# Altium project DARKYDEN.PrjPcb (part 4 of 15)

## Sheet HDMI.SchDoc: DARKYDEN_HDMI
size Letter; ApprovedBy: APPROUVÉ PAR; Author: Harold Malbrouck; Organization: Cegep Limoilou; Address1: 1300, 8e Avenue; Address2: Québec, QC; Address3: Canada; Address4: G1J 5L5; Revision: Rev.A; SheetNumber: 4; SheetTotal: 22
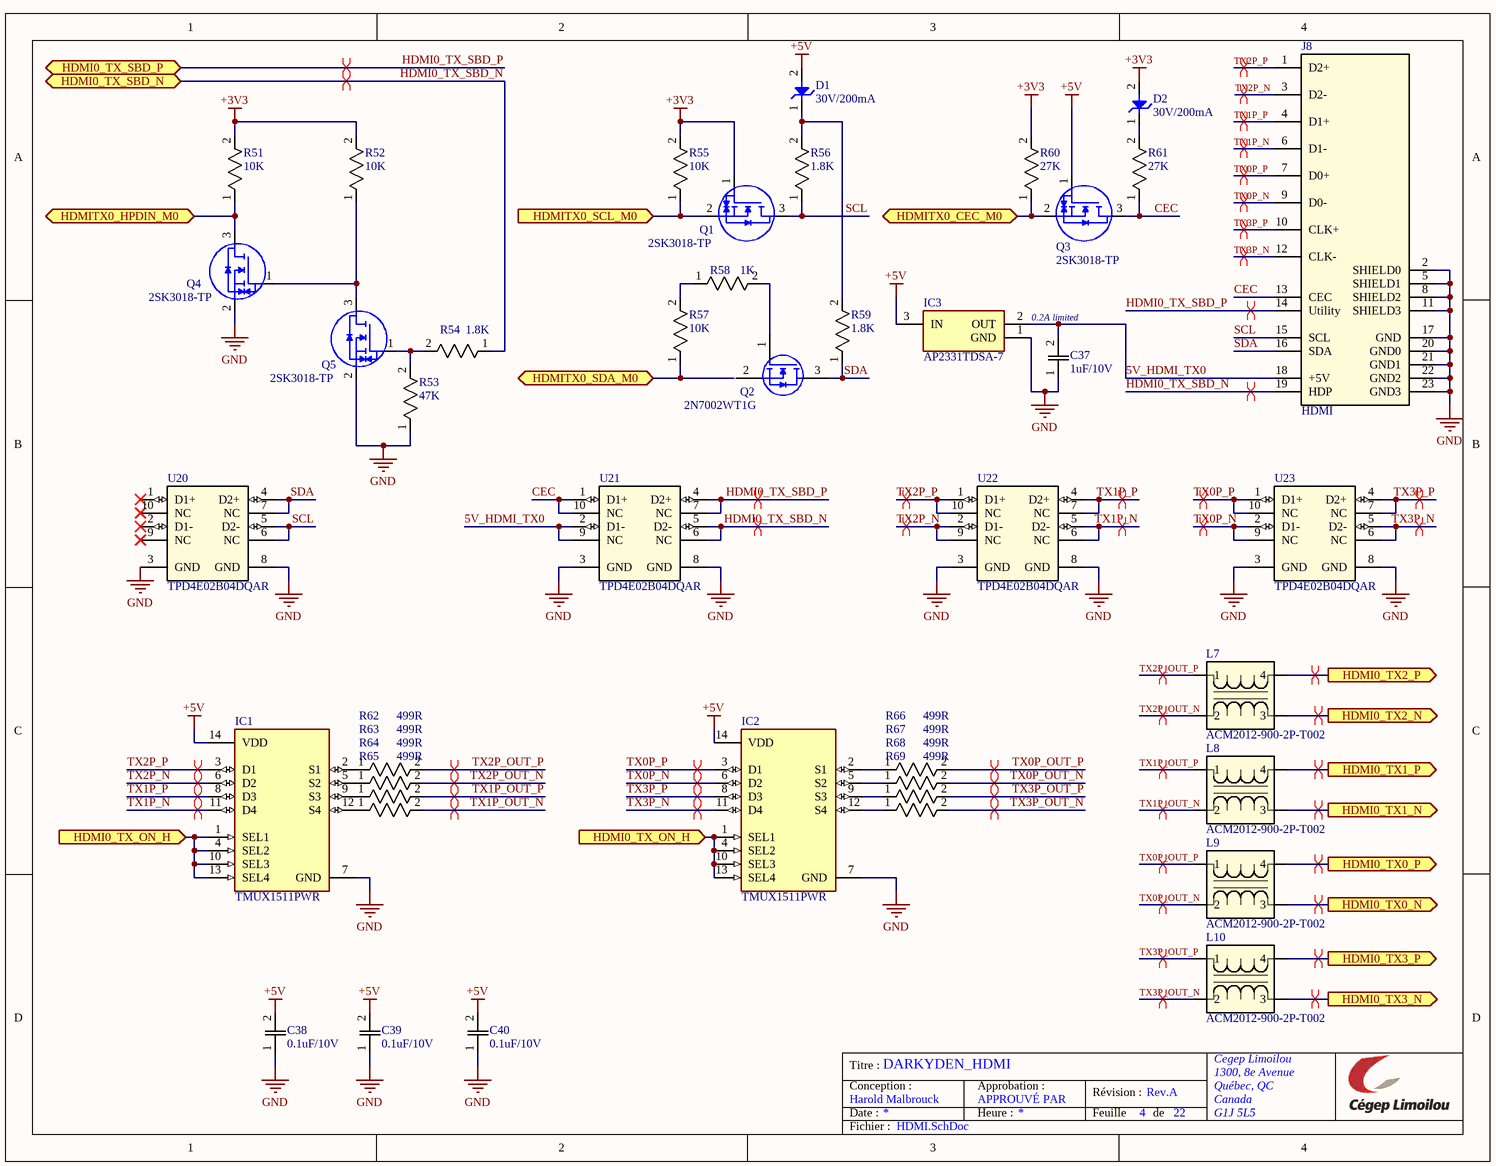
[diagram p3: HDMI.SchDoc]

### Parts
C37  1uF/10V  [CAPC220145_88N_KEM]
C38  0.1uF/10V  [CAPC220145_88N_KEM]
C39  0.1uF/10V  [CAPC220145_88N_KEM]
C40  0.1uF/10V  [CAPC220145_88N_KEM]
D1  30V/200mA  [SODFL1608X70N]
D2  30V/200mA  [SODFL1608X70N]
IC1  TMUX1511PWR  [SOP65P640X120-14N]
IC2  TMUX1511PWR  [SOP65P640X120-14N]
IC3  AP2331TDSA-7  [SOT96P240X110-3N]
J8  HDMI  [CONN19_2001-1-2-21-00-BK_CNC]
L7  ACM2012-900-2P-T002  [ACM20129002PT002]
L8  ACM2012-900-2P-T002  [ACM20129002PT002]
L9  ACM2012-900-2P-T002  [ACM20129002PT002]
L10  ACM2012-900-2P-T002  [ACM20129002PT002]
Q1  2SK3018-TP  [SOT65P228X120-3N]
Q2  2N7002WT1G  [SOT-323-3_2P2X1P35_ONS]
Q3  2SK3018-TP  [SOT65P228X120-3N]
Q4  2SK3018-TP  [SOT65P228X120-3N]
Q5  2SK3018-TP  [SOT65P228X120-3N]
R51  10K  [ERJ3EKF1000V]
R52  10K  [ERJ3EKF1000V]
R53  47K  [RC0603N_PAN]
R54  1.8K  [RC0603N_PAN]
R55  10K  [ERJ3EKF1000V]
R56  1.8K  [RC0603N_PAN]
R57  10K  [ERJ3EKF1000V]
R58  1K  [RESC1608X55N]
R59  1.8K  [RC0603N_PAN]
R60  27K  [RC0603N_PAN]
R61  27K  [RC0603N_PAN]
R62  499R  [RC0603N_PAN]
R63  499R  [RC0603N_PAN]
R64  499R  [RC0603N_PAN]
R65  499R  [RC0603N_PAN]
R66  499R  [RC0603N_PAN]
R67  499R  [RC0603N_PAN]
R68  499R  [RC0603N_PAN]
R69  499R  [RC0603N_PAN]
U20  TPD4E02B04DQAR  [DQA0010A]
U21  TPD4E02B04DQAR  [DQA0010A]
U22  TPD4E02B04DQAR  [DQA0010A]
U23  TPD4E02B04DQAR  [DQA0010A]

### Ports
HDMI0_TX0_N (out, see CONNECTEUR_4[1B]), HDMI0_TX0_P (out, see CONNECTEUR_4[1B]), HDMI0_TX1_N (out, see CONNECTEUR_4[1B]), HDMI0_TX1_P (out, see CONNECTEUR_4[1B]), HDMI0_TX2_N (out, see CONNECTEUR_4[1B]), HDMI0_TX2_P (out, see CONNECTEUR_4[1B]), HDMI0_TX3_N (out, see CONNECTEUR_4[1B]), HDMI0_TX3_P (out, see CONNECTEUR_4[1B]), HDMI0_TX_ON_H (in, see CONNECTEUR_4[1C], HDMI[1C]), HDMI0_TX_ON_H (in, see CONNECTEUR_4[1C], HDMI[2C]), HDMI0_TX_SBD_N (bidir, see CONNECTEUR_4[1B]), HDMI0_TX_SBD_P (bidir, see CONNECTEUR_4[1B]), HDMITX0_CEC_M0 (bidir, see CONNECTEUR_4[1B]), HDMITX0_HPDIN_M0 (bidir, see CONNECTEUR_3[1C]), HDMITX0_SCL_M0 (in, see CONNECTEUR_4[1B]), HDMITX0_SDA_M0 (bidir, see CONNECTEUR_4[1B])

### Nets
+3V3: D2.2(A) Q1.1(G) R51.2 R52.2 R55.2 R60.2  [project net VDD33A]
+5V: C38.2 C39.2 C40.2 D1.2(A) IC1.14(VDD) IC2.14(VDD) IC3.3(IN) Q3.1(G)
GND: C37.1 C38.1 C39.1 C40.1 IC1.7(GND) IC2.7(GND) IC3.1(GND) J8.2(SHIELD0) J8.5(SHIELD1) J8.8(SHIELD2) J8.11(SHIELD3) J8.17(GND) J8.20(GND0) J8.21(GND1) J8.22(GND2) J8.23(GND3) Q4.2(S) Q5.2(S) R53.1 U20.3(GND) U20.8(GND) U21.3(GND) U21.8(GND) U22.3(GND) U22.8(GND) U23.3(GND) U23.8(GND)  [project net PACK-]
5V_HDMI_TX0: C37.2 IC3.2(OUT) J8.18(+5V) U21.2(D1-) U21.9(NC)
CEC: J8.13(CEC) Q3.3(D) R61.1 U21.1(D1+) U21.10(NC)
HDMI0_TX0_N: L9.3 ; port HDMI0_TX0_N
HDMI0_TX0_P: L9.4 ; port HDMI0_TX0_P
HDMI0_TX1_N: L8.3 ; port HDMI0_TX1_N
HDMI0_TX1_P: L8.4 ; port HDMI0_TX1_P
HDMI0_TX2_N: L7.3 ; port HDMI0_TX2_N
HDMI0_TX2_P: L7.4 ; port HDMI0_TX2_P
HDMI0_TX3_N: L10.3 ; port HDMI0_TX3_N
HDMI0_TX3_P: L10.4 ; port HDMI0_TX3_P
HDMI0_TX_ON_H: IC1.1(SEL1) IC1.4(SEL2) IC1.10(SEL3) IC1.13(SEL4) IC2.1(SEL1) IC2.4(SEL2) IC2.10(SEL3) IC2.13(SEL4) ; port HDMI0_TX_ON_H
HDMI0_TX_SBD_N: J8.19(HDP) R54.1 U21.5(D2-) U21.6(NC) ; port HDMI0_TX_SBD_N
HDMI0_TX_SBD_P: J8.14(Utility) U21.4(D2+) U21.7(NC) ; port HDMI0_TX_SBD_P
HDMITX0_CEC_M0: Q3.2(S) R60.1 ; port HDMITX0_CEC_M0
HDMITX0_HPDIN_M0: Q4.3(D) R51.1 ; port HDMITX0_HPDIN_M0
HDMITX0_SCL_M0: Q1.2(S) R55.1 ; port HDMITX0_SCL_M0
HDMITX0_SDA_M0: R57.1 ; port HDMITX0_SDA_M0
SCL: J8.15(SCL) Q1.3(D) R56.1 U20.5(D2-) U20.6(NC)
SDA: J8.16(SDA) Q2.3(DRAIN) R59.1 U20.4(D2+) U20.7(NC)
TX0P_N: IC2.6(D2) J8.9(D0-) U23.2(D1-) U23.9(NC)
TX0P_OUT_N: L9.2 R67.2
TX0P_OUT_P: L9.1 R66.2
TX0P_P: IC2.3(D1) J8.7(D0+) U23.1(D1+) U23.10(NC)
TX1P_N: IC1.11(D4) J8.6(D1-) U22.5(D2-) U22.6(NC)
TX1P_OUT_N: L8.2 R65.2
TX1P_OUT_P: L8.1 R64.2
TX1P_P: IC1.8(D3) J8.4(D1+) U22.4(D2+) U22.7(NC)
TX2P_N: IC1.6(D2) J8.3(D2-) U22.2(D1-) U22.9(NC)
TX2P_OUT_N: L7.2 R63.2
TX2P_OUT_P: L7.1 R62.2
TX2P_P: IC1.3(D1) J8.1(D2+) U22.1(D1+) U22.10(NC)
TX3P_N: IC2.11(D4) J8.12(CLK-) U23.5(D2-) U23.6(NC)
TX3P_OUT_N: L10.2 R69.2
TX3P_OUT_P: L10.1 R68.2
TX3P_P: IC2.8(D3) J8.10(CLK+) U23.4(D2+) U23.7(NC)
NetD1_1: D1.1(K) R56.2 R59.2
NetD2_1: D2.1(K) R61.2
NetIC1_2: IC1.2(S1) R62.1
NetIC1_5: IC1.5(S2) R63.1
NetIC1_9: IC1.9(S3) R64.1
NetIC1_12: IC1.12(S4) R65.1
NetIC2_2: IC2.2(S1) R66.1
NetIC2_5: IC2.5(S2) R67.1
NetIC2_9: IC2.9(S3) R68.1
NetIC2_12: IC2.12(S4) R69.1
NetQ2_1: Q2.1(GATE) R58.2
NetQ4_1: Q4.1(G) Q5.3(D) R52.1
NetQ5_1: Q5.1(G) R53.2 R54.2
NetR57_2: R57.2 R58.1

Not connected (* = marked no-connect by the designer): Q2 2(SOURCE); U20 1(D1+)* 2(D1-)* 9(NC)* 10(NC)*

### Layout directives
differential pair: HDMI0_TX0_N, HDMI0_TX0_P, HDMI0_TX1_N, HDMI0_TX1_P, HDMI0_TX2_N, HDMI0_TX2_P, HDMI0_TX3_N, HDMI0_TX3_P, HDMI0_TX_SBD_N, HDMI0_TX_SBD_P, TX0P_N, TX0P_OUT_N, TX0P_OUT_P, TX0P_P, TX1P_N, TX1P_OUT_N, TX1P_OUT_P, TX1P_P, TX2P_N, TX2P_OUT_N, TX2P_OUT_P, TX2P_P, TX3P_N, TX3P_OUT_N, TX3P_OUT_P, TX3P_P

### Notes on the sheet
- 0.2A limited
- Titre :
- Conception :
- Date :
- Approbation :
- Heure :
- Révision :
- Feuille
- de
- Fichier :

### Library data of the parts
C37 = C0805C105K8RACTU: Multilayer Ceramic Capacitors MLCC - SMD/SMT 10V 1uF X7R 0805 10%; Mfr_Name: Kemet; Material: 4241ConductorMaterial; Dissipation Factor: 5%; Supplier: Digikey; Supplier Part Number: 399-C0805C105K8RACTUCT-ND; Manufacturer: KEMET; Manufacturer Part Number: C0805C105K8RACTU; RoHS: Yes; Category: Ceramic Capacitors; Stock: 113387; Pricing: 1=0.2, 10=0.112, 100=0.0701, 1000=0.04837 (USD); Mounting Technology: Surface Mount; Case/Package: 0805; Pins: 2NUMBER; Case Code (Imperial): 0805; Case Code (Metric): 2012; Dielectric Material: Ceramic; Min Operating Temperature: -55°C; Max Operating Temperature: 125°C; Packaging: Tape and Reel; Tolerance: 10%; Value: 1uF; Dielectric: X7R; Package Quantity: 1; Voltage Rating: 10V; Voltage Rating (DC): 10V; Termination: SMD/SMT; Voltage: 10V; Series: C; Construction: Flat; Length: 2mm; Width: 0.049inch; Height: 0.9mm; Depth: 1.25mm; Thickness: 0.039inch; Lead Pitch: 0.75mm; Radiation Hardening: No; Reach SVHC Compliant: No; RoHS Compliant: Yes; Lead Free: 5697LeadFree; ComponentLink1URL: https://datasheet.ciiva.com/6074/kem-c1002-x7r-smd-6074662.pdf?src-supplier=Farnell; ComponentLink1Description: https://datasheet.ciiva.com/6074/kem-c1002-x7r-smd-6074662.pdf?src-supplier=Farnell; ComponentLink2URL: https://datasheet.ciiva.com/22749/1918693-22749723.pdf?src-supplier=Element14; ComponentLink2Description: https://datasheet.ciiva.com/22749/1918693-22749723.pdf?src-supplier=Element14; ComponentLink3URL: https://datasheet.ciiva.com/46385/1851736-46385656.pdf?src-supplier=Element14; ComponentLink3Description: https://datasheet.ciiva.com/46385/1851736-46385656.pdf?src-supplier=Element14; ComponentLink4URL: https://datasheet.ciiva.com/46443/1851736-46443534.pdf?src-supplier=Element14; ComponentLink4Description: https://datasheet.ciiva.com/46443/1851736-46443534.pdf?src-supplier=Element14
C38-C40 = C0805C104J8RACTU: Cap Ceramic 0.1uF 10V X7R 5% Pad SMD 0805 125C T/R; Mfr_Name: Kemet; Material: 4241ConductorMaterial; Value: 100nF; Temperature Coefficient: 30ppm/°C; Supplier: Digikey; Supplier Part Number: 399-C0805C104J8RACTUCT-ND; Manufacturer: KEMET; Manufacturer Part Number: C0805C104J8RACTU; RoHS: Yes; Category: Ceramic Capacitors; Stock: 7602; Pricing: 1=0.54, 10=0.331, 100=0.1983, 1000=0.14915 (USD); Mounting Technology: Surface Mount; Case/Package: 0805; Case Code (Metric): 2012; Case Code (Imperial): 0805; Dielectric Material: Ceramic; Min Operating Temperature: -55°C; Max Operating Temperature: 125°C; Voltage Rating: 10V; Voltage Rating (DC): 10V; Tolerance: 5%; Packaging: Tape and Reel; Package Quantity: 1; Dielectric: X7R; Termination: SMD/SMT; Series: C; Construction: Flat; Length: 2mm; Width: 0.049inch; Height: 0.9mm; Thickness: 0.035inch; Lead Pitch: 0.75mm; Depth: 1.25mm; Radiation Hardening: No; Reach SVHC Compliant: No; RoHS Compliant: Yes; ComponentLink1URL: http://www.farnell.com/datasheets/2552466.pdf?src-supplier=Farnell; ComponentLink1Description: http://www.farnell.com/datasheets/2552466.pdf?src-supplier=Farnell; ComponentLink2URL: http://www.mouser.com/ds/2/212/KEM_C1002_X7R_SMD-1102033.pdf?src-supplier=Mouser; ComponentLink2Description: http://www.mouser.com/ds/2/212/KEM_C1002_X7R_SMD-1102033.pdf?src-supplier=Mouser; ComponentLink3URL: http://datasheet.octopart.com/C0805C104J8RACTU-KEMET-datasheet-100087375.pdf?src-supplier=Avnet; ComponentLink3Description: http://datasheet.octopart.com/C0805C104J8RACTU-KEMET-datasheet-100087375.pdf?src-supplier=Avnet; ComponentLink4URL: http://datasheet.octopart.com/C0805C104J8RACTU-KEMET-datasheet-100087375.pdf?src-supplier=Onlinecomponents.com; ComponentLink4Description: http://datasheet.octopart.com/C0805C104J8RACTU-KEMET-datasheet-100087375.pdf?src-supplier=Onlinecomponents.com; ComponentLink5URL: http://capacitoredge.kemet.com/capedge2/DataSheet?pn=C0805C104J8RACTU&src-supplier=Avnet; ComponentLink5Description: http://capacitoredge.kemet.com/capedge2/DataSheet?pn=C0805C104J8RACTU&src-supplier=Avnet; ComponentLink6URL: https://datasheet.octopart.com/C0805C104J8RACTU-KEMET-datasheet-170333832.pdf?src-supplier=Newark; ComponentLink6Description: https://datasheet.octopart.com/C0805C104J8RACTU-KEMET-datasheet-170333832.pdf?src-supplier=Newark; ComponentLink7URL: http://datasheet.octopart.com/C0805C104J8RACTU-KEMET-datasheet-100087375.pdf?src-supplier=Digikey; ComponentLink7Description: http://datasheet.octopart.com/C0805C104J8RACTU-KEMET-datasheet-100087375.pdf?src-supplier=Digikey; ComponentLink8URL: https://search.kemet.com/component-edge/download/datasheet/C0805C104J8RACTU.pdf?src-supplier=Digikey; ComponentLink8Description: https://search.kemet.com/component-edge/download/datasheet/C0805C104J8RACTU.pdf?src-supplier=Digikey; ComponentLink9URL: https://api.kemet.com/component-edge/download/datasheet/C0805C104J8RACTU.pdf?src-supplier=Digikey; ComponentLink9Description: https://api.kemet.com/component-edge/download/datasheet/C0805C104J8RACTU.pdf?src-supplier=Digikey; ComponentLink10URL: https://datasheet.octopart.com/C0805C104J8RACTU-Kemet-datasheet-62307647.pdf?src-supplier=Element14; ComponentLink10Description: https://datasheet.octopart.com/C0805C104J8RACTU-Kemet-datasheet-62307647.pdf?src-supplier=Element14; ComponentLink11URL: https://datasheet.octopart.com/C0805C104J8RACTU-KEMET-datasheet-100087375.pdf?src-supplier=Farnell; ComponentLink11Description: https://datasheet.octopart.com/C0805C104J8RACTU-KEMET-datasheet-100087375.pdf?src-supplier=Farnell; ComponentLink12URL: http://datasheet.octopart.com/C0805C104J8RACTU-KEMET-datasheet-100087375.pdf?src-supplier=TTI; ComponentLink12Description: http://datasheet.octopart.com/C0805C104J8RACTU-KEMET-datasheet-100087375.pdf?src-supplier=TTI; ComponentLink13URL: https://datasheet.octopart.com/C0805C104J8RACTU-KEMET-datasheet-37550250.pdf?src-supplier=Electro+Sonic; ComponentLink13Description: https://datasheet.octopart.com/C0805C104J8RACTU-KEMET-datasheet-37550250.pdf?src-supplier=Electro+Sonic
D1 D2 = RB521S30T1G: SCHOTTKY BARRIER DIODE Rectifier Diode, Schottky, 1 Phase, 1 Element, 0.2A, 30V V(RRM), Silicon; Manufacturer_Name: onsemi; Manufacturer: ON Semiconductor; Forward Current: 200mA; Element Configuration: Single; Peak Non-Repetitive Surge Current: 1A; Max Reverse Current: 30uA; Forward Voltage: 500mV; Power Dissipation: 200mW; Polarity: Standard; Datasheet Link: https://www.onsemi.com/pub/Collateral/RB521S30T1-D.PDF; Height: 0.7mm; Manufacturer_Part_Number: RB521S30T1G; Mouser Part Number: 863-RB521S30T1G; Mouser Price/Stock: https://www.mouser.co.uk/ProductDetail/onsemi/RB521S30T1G?qs=xZq1yRCsb1eKFKS8TVH%2Fqg%3D%3D; Arrow Part Number: RB521S30T1G; Arrow Price/Stock: https://www.arrow.com/en/products/rb521s30t1g/on-semiconductor?region=europe; Supplier: Digikey; Supplier Part Number: RB521S30T1GOSCT-ND; Manufacturer Part Number: RB521S30T1G; RoHS: Yes; Category: Rectifier Diodes; Stock: 15002; Pricing: 1=0.1, 10=0.065, 100=0.0546, 500=0.0395, 1000=0.0309 (USD); Case/Package: SOD-523-2; Pins: 2; Min Operating Temperature: -55°C; Max Operating Temperature: 125°C; Package Quantity: 1; Packaging: Tape and Reel; Max Repetitive Reverse Voltage (Vrrm): 30V; Series: -; Average Rectified Current: 200mA; Max Forward Surge Current (Ifsm): 1A; Current Rating: 200mA; Max Reverse Voltage (DC): 30V; Max Surge Current: 1A; Max Reverse Leakage Current: 30uA; Voltage Rating (DC): 30V; Output Current: 200mA; Length: 1.3mm; Width: 0.9mm; Radiation Hardening: No; RoHS Compliant: Yes; Lead Free: Lead Free; Reach SVHC Compliant: No; ComponentLink1URL: https://datasheet.ciiva.com/915/rb521s30t1-d-915380.pdf?src-supplier=Digikey; ComponentLink1Description: https://datasheet.ciiva.com/915/rb521s30t1-d-915380.pdf?src-supplier=Digikey; ComponentLink2URL: https://datasheet.ciiva.com/30479/0900766b8127cb13-30479125.pdf?src-supplier=Rs; ComponentLink2Description: https://datasheet.ciiva.com/30479/0900766b8127cb13-30479125.pdf?src-supplier=Rs; ComponentLink3URL: https://datasheet.ciiva.com/34302/1188931-34302065.pdf?src-supplier=Jameco; ComponentLink3Description: https://datasheet.ciiva.com/34302/1188931-34302065.pdf?src-supplier=Jameco; ComponentLink4URL: https://datasheet.ciiva.com/1243/rb521s30t1-d-1243283.pdf?src-supplier=Newark; ComponentLink4Description: https://datasheet.ciiva.com/1243/rb521s30t1-d-1243283.pdf?src-supplier=Newark; ComponentLink5URL: https://datasheet.ciiva.com/915/rb521s30t1-d-915382.pdf?src-supplier=Digikey; ComponentLink5Description: https://datasheet.ciiva.com/915/rb521s30t1-d-915382.pdf?src-supplier=Digikey; ComponentLink6URL: https://datasheet.ciiva.com/16221/rb521s30t1-d-16221823.pdf?src-supplier=Future+Electronics; ComponentLink6Description: https://datasheet.ciiva.com/16221/rb521s30t1-d-16221823.pdf?src-supplier=Future+Electronics
IC1 IC2 = TMUX1511PWR: 5-V, 1: 1 (SPST), 4-channel analog switch with powered-off protection & 1.8-V input logic 14-TSSOP -40 to 125; Manufacturer_Name: Texas Instruments; Datasheet Link: http://www.ti.com/lit/ds/symlink/tmux1511.pdf; Height: 1.2mm; Manufacturer_Part_Number: TMUX1511PWR; Mouser Part Number: 595-TMUX1511PWR; Mouser Price/Stock: https://www.mouser.co.uk/ProductDetail/Texas-Instruments/TMUX1511PWR?qs=qSfuJ%252Bfl%2Fd5zYDGvtvg4tg%3D%3D; Arrow Part Number: TMUX1511PWR; Arrow Price/Stock: https://www.arrow.com/en/products/tmux1511pwr/texas-instruments?utm_currency=USD&region=nac; Supplier: Digikey; Supplier Part Number: 296-53442-1-ND; Manufacturer: Texas Instruments; Manufacturer Part Number: TMUX1511PWR; RoHS: Yes; Category: Interface ICs; Stock: 15687; Pricing: 1=0.39, 10=0.272, 25=0.242, 100=0.2093, 250=0.19364, 500=0.1842, 1000=0.17643 (USD); RoHS Compliant: Yes; ComponentLink1URL: http://www.ti.com/general/docs/suppproductinfo.tsp?distId=10&amp;gotoUrl=http%3A%2F%2Fwww.ti.com%2Flit%2Fgpn%2Ftmux1511&src-supplier=Digikey; ComponentLink1Description: http://www.ti.com/general/docs/suppproductinfo.tsp?distId=10&amp;gotoUrl=http%3A%2F%2Fwww.ti.com%2Flit%2Fgpn%2Ftmux1511&src-supplier=Digikey
IC3 = AP2331TDSA-7: USB Power Switch Single 5.2V 0.4A 3-Pin SOT-23 T/R; Manufacturer_Name: Diodes Incorporated; Manufacturer: Diodes; Output Current: 200mA; Number of Channels: 1NUMBER; Datasheet Link: https://www.diodes.com//assets/Datasheets/AP2331TD.pdf; Height: 1.1mm; Manufacturer_Part_Number: AP2331TDSA-7; Mouser Part Number: 621-AP2331TDSA-7; Mouser Price/Stock: https://www.mouser.co.uk/ProductDetail/Diodes-Incorporated/AP2331TDSA-7?qs=W0yvOO0ixfEfFxPGIHJ0Tw%3D%3D; Arrow Part Number: AP2331TDSA-7; Arrow Price/Stock: https://www.arrow.com/en/products/ap2331tdsa-7/diodes-incorporated?region=nac; Supplier: Digikey; Supplier Part Number: AP2331TDSA-7DICT-ND; Manufacturer Part Number: AP2331TDSA-7; RoHS: Yes; Category: USB Interface ICs; Stock: 6292; Pricing: 1=0.57, 10=0.339, 25=0.2784, 100=0.2098, 250=0.176, 500=0.1552, 1000=0.13777 (USD); Mounting Technology: Surface Mount; Case/Package: TO-236-3; Min Operating Temperature: -40°C; Max Operating Temperature: 85°C; Packaging: Cut Tape; Series: -; RoHS Compliant: Yes; ComponentLink1URL: https://www.diodes.com/assets/Datasheets/AP2331TD.pdf?src-supplier=Digikey; ComponentLink1Description: https://www.diodes.com/assets/Datasheets/AP2331TD.pdf?src-supplier=Digikey; ComponentLink2URL: https://datasheet.octopart.com/AP2331TDSA-7-Diodes-Inc.-datasheet-150576120.pdf?src-supplier=SHENGYU+ELECTRONICS; ComponentLink2Description: https://datasheet.octopart.com/AP2331TDSA-7-Diodes-Inc.-datasheet-150576120.pdf?src-supplier=SHENGYU+ELECTRONICS
J8 = HDMI: 2001-1-2-21-00-BK; Mfr_Name: CNC Tech; RefDes: RefDes; Type: Type
L7-L10 = ACM2012-900-2P-T002: Ferrite Beads Wirewound Common Mode Filter 90Ohm 100MHz 400mA 0805 T/R; Manufacturer_Name: TDK; Impedance: 90R; Voltage Rating: 50V; Number of Lines: 2; DC Resistance (DCR): 190mR; Shielding: Shielded; Datasheet Link: https://product.tdk.com/system/files/dam/doc/product/emc/emc/cmf_cmc/catalog/cmf_commercial_signal_acm2012_en.pdf; Height: 1.3mm; Manufacturer_Part_Number: ACM2012-900-2P-T002; Mouser Part Number: 810-ACM20129002PT002; Mouser Price/Stock: https://www.mouser.co.uk/ProductDetail/TDK/ACM2012-900-2P-T002?qs=vhEaPADELPHXWaCJFQVZjQ%3D%3D; Arrow Part Number: ACM2012-900-2P-T002; Arrow Price/Stock: https://www.arrow.com/en/products/acm2012-900-2p-t002/tdk?utm_currency=USD&region=europe; Supplier: Digikey; Supplier Part Number: 445-2207-1-ND; Manufacturer: TDK; Manufacturer Part Number: ACM2012-900-2P-T002; RoHS: Yes; Category: Common Mode Chokes; Stock: 26254; Pricing: 1=0.34, 10=0.277, 25=0.2564, 50=0.2416, 100=0.2278, 250=0.21076, 500=0.1987, 1000=0.18735 (USD); Mounting Technology: Surface Mount; Case/Package: 0805; Pins: 4; Case Code (Metric): 2012; Case Code (Imperial): 0805; Core Material: Ferrite; Min Operating Temperature: -40°C; Max Operating Temperature: 85°C; Packaging: Tape and Reel; Package Quantity: 1; Voltage Rating (DC): 50V; Current Rating: 400mA; Max DC Current: 400mA; Termination: SMD/SMT; Test Frequency: 100MHz; Current: 400mA; DC Current: 400mA; Series: ACM; DC Resistance-Max: 190mR; Max Current Rating: 400mA; RMS Current (Irms): 400mA; ESR: 190mR; Coil Resistance: 190mR; Length: 2.2mm; Width: 0.047inch; Depth: 1.4mm; Radiation Hardening: No; Reach SVHC Compliant: No; Military Standard: Not; RoHS Compliant: Yes; Lead Free: 5697LeadFree; ComponentLink1URL: https://datasheet.ciiva.com/26946/getdatasheetpartid-664745-26946491.pdf?src-supplier=Verical; ComponentLink1Description: https://datasheet.ciiva.com/26946/getdatasheetpartid-664745-26946491.pdf?src-supplier=Verical; ComponentLink2URL: https://datasheet.ciiva.com/1127/1750020-1127257.pdf?src-supplier=Element14; ComponentLink2Description: https://datasheet.ciiva.com/1127/1750020-1127257.pdf?src-supplier=Element14; ComponentLink3URL: https://datasheet.ciiva.com/22726/1750020-22726278.pdf?src-supplier=Element14; ComponentLink3Description: https://datasheet.ciiva.com/22726/1750020-22726278.pdf?src-supplier=Element14; ComponentLink4URL: https://datasheet.ciiva.com/28428/1750020-28428616.pdf?src-supplier=Element14; ComponentLink4Description: https://datasheet.ciiva.com/28428/1750020-28428616.pdf?src-supplier=Element14; ComponentLink5URL: https://datasheet.ciiva.com/46450/1750020-46450939.pdf?src-supplier=Element14; ComponentLink5Description: https://datasheet.ciiva.com/46450/1750020-46450939.pdf?src-supplier=Element14; ComponentLink6URL: https://datasheet.ciiva.com/1007/e9712-acm-1007624.pdf?src-supplier=Digikey; ComponentLink6Description: https://datasheet.ciiva.com/1007/e9712-acm-1007624.pdf?src-supplier=Digikey; ComponentLink7URL: https://datasheet.ciiva.com/1007/e9712-acm-1007623.pdf?src-supplier=Digikey; ComponentLink7Description: https://datasheet.ciiva.com/1007/e9712-acm-1007623.pdf?src-supplier=Digikey; ComponentLink8URL: https://datasheet.ciiva.com/1007/e9712-acm-1007625.pdf?src-supplier=Digikey; ComponentLink8Description: https://datasheet.ciiva.com/1007/e9712-acm-1007625.pdf?src-supplier=Digikey; ComponentLink9URL: https://datasheet.ciiva.com/4941/tdk-e9712-acm-332263-4941941.pdf?src-supplier=Mouser; ComponentLink9Description: https://datasheet.ciiva.com/4941/tdk-e9712-acm-332263-4941941.pdf?src-supplier=Mouser; ComponentLink10URL: https://datasheet.ciiva.com/16416/e9712-acm-16416522.pdf?src-supplier=Future+Electronics; ComponentLink10Description: https://datasheet.ciiva.com/16416/e9712-acm-16416522.pdf?src-supplier=Future+Electronics; ComponentLink11URL: https://datasheet.ciiva.com/8498/e9712-acm-8498823.pdf?src-supplier=Avnet; ComponentLink11Description: https://datasheet.ciiva.com/8498/e9712-acm-8498823.pdf?src-supplier=Avnet; ComponentLink12URL: https://datasheet.ciiva.com/16382/e9712-acm-16382582.pdf?src-supplier=Future+Electronics; ComponentLink12Description: https://datasheet.ciiva.com/16382/e9712-acm-16382582.pdf?src-supplier=Future+Electronics
Q1 Q3-Q5 = 2SK3018-TP: N-Channel 30 V 100mA (Ta) 200mW (Ta) Surface Mount SOT-323; Manufacturer_Name: MCC; Datasheet Link: https://mccsemi.com/pdf/Products/2SK3018(SOT-323).pdf; Height: 1.2mm; Manufacturer_Part_Number: 2SK3018-TP; Mouser Part Number: 833-2SK3018-TP; Mouser Price/Stock: https://www.mouser.co.uk/ProductDetail/Micro-Commercial-Components-MCC/2SK3018-TP?qs=MoCBKJu1Jj0hqZl4P%2F2qSQ%3D%3D; Arrow Part Number: 2SK3018-TP; Arrow Price/Stock: https://www.arrow.com/en/products/2sk3018-tp/micro-commercial-components?region=europe
Q2 = 2N7002WT1G: No Description Available; Mfr_Name: onsemi; RefDes: RefDes; Type: Type
R51 R52 R55 R57 = ERJ-3GEYJ103V: 10K Ohm 5% Res Thick Film 0603  0.1W(1/10W) ±200ppm/C Pad SMD Automotive T/R; Manufacturer_Name: Panasonic; Value: 10kR; Temperature Coefficient: 200ppm/°C; Power Rating: 100mW; Voltage Rating: 75V; Datasheet Link: http://docs-europe.electrocomponents.com/webdocs/13ba/0900766b813ba21b.pdf; Height: 0.55mm; Manufacturer_Part_Number: ERJ-3GEYJ103V; Mouser Part Number: 667-ERJ-3GEYJ103V; Mouser Price/Stock: https://www.mouser.co.uk/ProductDetail/Panasonic/ERJ-3GEYJ103V?qs=66DK8nO8gJBWgc%252B0VNNxzg%3D%3D; Arrow Part Number: ERJ-3GEYJ103V; Arrow Price/Stock: https://www.arrow.com/en/products/erj-3geyj103v/panasonic?region=europe; Supplier: Digikey; Supplier Part Number: P10KGCT-ND; Manufacturer: Panasonic; Manufacturer Part Number: ERJ-3GEYJ103V; RoHS: Yes; Category: Chip SMD Resistors; Stock: 2191587; Pricing: 1=0.1, 10=0.033, 50=0.02, 100=0.0165, 500=0.01096, 1000=0.00939 (USD); Mounting Technology: Surface Mount; Case/Package: 0603; Case Code (Imperial): 0603; Case Code (Metric): 1608; Weight: 7.1E-05oz; Contact Plating: Tin; Min Operating Temperature: -55°C; Max Operating Temperature: 155°C; Tolerance: 5%; Packaging: Tape and Reel; Technology: THICK FILM; Package Quantity: 1; Resistor Type: Thick Film; Termination: SMD/SMT; Number of Terminations: 2; Max Power Dissipation: 100mW; Working Voltage: 75V; Features: Automotive AEC-Q200; Series: ERJ; Construction: Rectangular; Resistance Tolerance: 5%; Length: 1.6mm; Width: 0.8mm; Depth: 0.8mm; Reach SVHC Compliant: No; Military Standard: Not; Lead Free: Lead Free; RoHS Compliant: Yes; ComponentLink1URL: https://datasheet.ciiva.com/11809/0900766b80f806dd-11809566.pdf?src-supplier=Rs; ComponentLink1Description: https://datasheet.ciiva.com/11809/0900766b80f806dd-11809566.pdf?src-supplier=Rs; ComponentLink2URL: https://datasheet.ciiva.com/34303/2007265-34303757.pdf?src-supplier=Jameco; ComponentLink2Description: https://datasheet.ciiva.com/34303/2007265-34303757.pdf?src-supplier=Jameco; ComponentLink3URL: https://datasheet.ciiva.com/48531/aoa0000ce1-48531887.pdf?src-supplier=Avnet; ComponentLink3Description: https://datasheet.ciiva.com/48531/aoa0000ce1-48531887.pdf?src-supplier=Avnet; ComponentLink4URL: https://datasheet.ciiva.com/9117/aoa0000ce1-9117038.pdf?src-supplier=Avnet; ComponentLink4Description: https://datasheet.ciiva.com/9117/aoa0000ce1-9117038.pdf?src-supplier=Avnet; ComponentLink5URL: https://datasheet.ciiva.com/28514/1678796-28514213.pdf?src-supplier=Element14; ComponentLink5Description: https://datasheet.ciiva.com/28514/1678796-28514213.pdf?src-supplier=Element14; ComponentLink6URL: https://datasheet.ciiva.com/46371/1678796-46371909.pdf?src-supplier=Element14; ComponentLink6Description: https://datasheet.ciiva.com/46371/1678796-46371909.pdf?src-supplier=Element14; ComponentLink7URL: https://datasheet.ciiva.com/46385/1678796-46385240.pdf?src-supplier=Element14; ComponentLink7Description: https://datasheet.ciiva.com/46385/1678796-46385240.pdf?src-supplier=Element14; ComponentLink8URL: https://datasheet.ciiva.com/24133/aoa0000ce1-37422-24133064.pdf?src-supplier=Mouser; ComponentLink8Description: https://datasheet.ciiva.com/24133/aoa0000ce1-37422-24133064.pdf?src-supplier=Mouser; ComponentLink9URL: https://datasheet.ciiva.com/16740/aoa0000ce1-16740655.pdf?src-supplier=Future+Electronics; ComponentLink9Description: https://datasheet.ciiva.com/16740/aoa0000ce1-16740655.pdf?src-supplier=Future+Electronics; ComponentLink10URL: https://datasheet.ciiva.com/30147/4aoa0000ce1-30147029.pdf?src-supplier=Onlinecomponents.com; ComponentLink10Description: https://datasheet.ciiva.com/30147/4aoa0000ce1-30147029.pdf?src-supplier=Onlinecomponents.com
R53 = ERJ-3GEYJ473V: Resistor Thick Film 0603 47K Ohm 5% 1/10W 200ppm/C Molded SMD Punched Carrier T/R; Mfr_Name: Panasonic; Voltage Rating: 75V; Voltage Rating (DC): 50V; Value: 47kR; Power Rating: 100mW; Temperature Coefficient: 200ppm/°C; Supplier: Digikey; Supplier Part Number: P47KGCT-ND; Manufacturer: Panasonic; Manufacturer Part Number: ERJ-3GEYJ473V; RoHS: Yes; Category: Chip SMD Resistors; Stock: 564429; Pricing: 1=0.1, 10=0.033, 50=0.02, 100=0.0165, 500=0.01096, 1000=0.00939 (USD); Mounting Technology: Surface Mount; Case/Package: 0603; Contact Plating: Tin; Case Code (Metric): 1608; Case Code (Imperial): 0603; Min Operating Temperature: -55°C; Max Operating Temperature: 155°C; Package Quantity: 1; Termination: SMD/SMT; Series: ERJ; Tolerance: 5%; Packaging: Tape and Reel; Resistor Type: Thick Film; Number of Terminations: 2; Max Power Dissipation: 100mW; Features: Automotive AEC-Q200; Construction: Rectangular; Resistance Tolerance: 5%; Technology: THICK FILM; Length: 1.6mm; Width: 0.8mm; Height: 0.45mm; Depth: 0.8mm; Radiation Hardening: No; Reach SVHC Compliant: No; Lead Free: Lead Free; Military Standard: Not; RoHS Compliant: Yes; ComponentLink1URL: https://datasheet.ciiva.com/11821/0900766b80f806dd-11821464.pdf?src-supplier=Rs; ComponentLink1Description: https://datasheet.ciiva.com/11821/0900766b80f806dd-11821464.pdf?src-supplier=Rs; ComponentLink2URL: https://datasheet.ciiva.com/48531/aoa0000ce1-48531644.pdf?src-supplier=Avnet; ComponentLink2Description: https://datasheet.ciiva.com/48531/aoa0000ce1-48531644.pdf?src-supplier=Avnet; ComponentLink3URL: https://datasheet.ciiva.com/24024/aoa0000ce1-37422-24024310.pdf?src-supplier=Mouser; ComponentLink3Description: https://datasheet.ciiva.com/24024/aoa0000ce1-37422-24024310.pdf?src-supplier=Mouser; ComponentLink4URL: https://datasheet.ciiva.com/28587/1678796-28587208.pdf?src-supplier=Element14; ComponentLink4Description: https://datasheet.ciiva.com/28587/1678796-28587208.pdf?src-supplier=Element14; ComponentLink5URL: https://datasheet.ciiva.com/28681/1678796-28681548.pdf?src-supplier=Element14; ComponentLink5Description: https://datasheet.ciiva.com/28681/1678796-28681548.pdf?src-supplier=Element14; ComponentLink6URL: https://datasheet.ciiva.com/46377/1500035-46377557.pdf?src-supplier=Element14; ComponentLink6Description: https://datasheet.ciiva.com/46377/1500035-46377557.pdf?src-supplier=Element14; ComponentLink7URL: https://datasheet.ciiva.com/46389/1500035-46389464.pdf?src-supplier=Element14; ComponentLink7Description: https://datasheet.ciiva.com/46389/1500035-46389464.pdf?src-supplier=Element14
R54 R56 R59 = ERJ-3GEYJ182V: SMD Chip Resistor, 1.8 kOhm, ± 5%, 100 mW, 0603 [1608 Metric], Thick Film, General Purpose; Mfr_Name: Panasonic; Value: 1.8kR; Power Rating: 100mW; Voltage Rating: 75V; Temperature Coefficient: 200ppm/°C; Voltage Rating (DC): 50V; Supplier: Digikey; Supplier Part Number: P1.8KGCT-ND; Manufacturer: Panasonic; Manufacturer Part Number: ERJ-3GEYJ182V; RoHS: Yes; Category: Chip SMD Resistors; Stock: 204507; Pricing: 1=0.1, 10=0.033, 50=0.02, 100=0.0165, 500=0.01096, 1000=0.00939 (USD); Mounting Technology: Surface Mount; Case/Package: 0603; Case Code (Metric): 1608; Case Code (Imperial): 0603; Contact Plating: Tin; Min Operating Temperature: -55°C; Max Operating Temperature: 155°C; Tolerance: 5%; Packaging: Tape and Reel; Package Quantity: 5000; Resistor Type: Thick Film; Number of Terminations: 2; Termination: SMD/SMT; Max Power Dissipation: 100mW; Features: Automotive AEC-Q200; Series: ERJ; Construction: Rectangular; Resistance Tolerance: 5%; Technology: THICK FILM; Length: 1.6mm; Width: 0.8mm; Height: 0.45mm; Depth: 0.8mm; Radiation Hardening: No; Reach SVHC Compliant: No; Military Standard: Not; Lead Free: Lead Free; RoHS Compliant: Yes; ComponentLink1URL: https://datasheet.ciiva.com/11821/0900766b80f806dd-11821432.pdf?src-supplier=Rs; ComponentLink1Description: https://datasheet.ciiva.com/11821/0900766b80f806dd-11821432.pdf?src-supplier=Rs; ComponentLink2URL: https://datasheet.ciiva.com/30254/4aoa0000ce1-30254454.pdf?src-supplier=Onlinecomponents.com; ComponentLink2Description: https://datasheet.ciiva.com/30254/4aoa0000ce1-30254454.pdf?src-supplier=Onlinecomponents.com; ComponentLink3URL: https://datasheet.ciiva.com/9117/aoa0000ce1-9117098.pdf?src-supplier=Avnet; ComponentLink3Description: https://datasheet.ciiva.com/9117/aoa0000ce1-9117098.pdf?src-supplier=Avnet; ComponentLink4URL: https://datasheet.ciiva.com/16766/70255313-16766154.pdf?src-supplier=Allied+Electronics; ComponentLink4Description: https://datasheet.ciiva.com/16766/70255313-16766154.pdf?src-supplier=Allied+Electronics; ComponentLink5URL: https://datasheet.ciiva.com/16772/70255313-16772088.pdf?src-supplier=Allied+Electronics; ComponentLink5Description: https://datasheet.ciiva.com/16772/70255313-16772088.pdf?src-supplier=Allied+Electronics; ComponentLink6URL: https://datasheet.ciiva.com/46440/1500035-46440095.pdf?src-supplier=Element14; ComponentLink6Description: https://datasheet.ciiva.com/46440/1500035-46440095.pdf?src-supplier=Element14
R58 = ERJ-3EKF1001V: 1K Ohm 1% 1/10W Res Thick Film 0603 ±100ppm/°C Molded SMD Punched Carrier T/R; Manufacturer_Name: Panasonic; Value: 1kR; Power Rating: 100mW; Voltage Rating: 75V; Datasheet Link: http://industrial.panasonic.com/cdbs/www-data/pdf/RDA0000/AOA0000C86.pdf; Height: 0.55mm; Manufacturer_Part_Number: ERJ-3EKF1001V; Mouser Part Number: 667-ERJ-3EKF1001V; Mouser Price/Stock: https://www.mouser.co.uk/ProductDetail/Panasonic/ERJ-3EKF1001V?qs=H7k1u0Mp9JTM8yQxOuvoDg%3D%3D; Arrow Part Number: ERJ-3EKF1001V; Arrow Price/Stock: https://www.arrow.com/en/products/erj-3ekf1001v/panasonic?utm_currency=USD&region=europe; Supplier: Digikey; Supplier Part Number: P1.00KHCT-ND; Manufacturer: Panasonic; Manufacturer Part Number: ERJ-3EKF1001V; RoHS: Yes; Category: Chip SMD Resistors; Stock: 1610348; Pricing: 1=0.1, 10=0.035, 100=0.0177, 1000=0.01014, 2500=0.00847 (USD); Mounting Technology: Surface Mount; Case/Package: 0603; Pins: 2; Case Code (Metric): 1608; Case Code (Imperial): 0603; Contact Plating: Tin; Min Operating Temperature: -55°C; Max Operating Temperature: 155°C; Tolerance: 1%; Temperature Coefficient: 100ppm/°C; Packaging: Tape and Reel; Package Quantity: 5000; Resistor Type: Thick Film; Number of Terminations: 2; Termination: SMD/SMT; Max Power Dissipation: 100mW; Voltage Rating (DC): 75V; Features: Automotive AEC-Q200; Series: ERJ; Technology: THICK FILM; Construction: Rectangular; Resistance Tolerance: 1%; Length: 1.6mm; Width: 0.8mm; Depth: 0.8mm; Radiation Hardening: No; Reach SVHC Compliant: No; Military Standard: Not; RoHS Compliant: Yes; ComponentLink1URL: https://datasheet.ciiva.com/48530/aoa0000ce2-48530987.pdf?src-supplier=Avnet; ComponentLink1Description: https://datasheet.ciiva.com/48530/aoa0000ce2-48530987.pdf?src-supplier=Avnet; ComponentLink2URL: https://datasheet.ciiva.com/30063/aoa0000ce2-30063390.pdf?src-supplier=Onlinecomponents.com; ComponentLink2Description: https://datasheet.ciiva.com/30063/aoa0000ce2-30063390.pdf?src-supplier=Onlinecomponents.com; ComponentLink3URL: https://datasheet.ciiva.com/16449/aoa0000ce2-16449065.pdf?src-supplier=Future+Electronics; ComponentLink3Description: https://datasheet.ciiva.com/16449/aoa0000ce2-16449065.pdf?src-supplier=Future+Electronics; ComponentLink4URL: https://datasheet.ciiva.com/22673/1678782-22673918.pdf?src-supplier=Element14; ComponentLink4Description: https://datasheet.ciiva.com/22673/1678782-22673918.pdf?src-supplier=Element14; ComponentLink5URL: https://datasheet.ciiva.com/16768/70260748-16768437.pdf?src-supplier=Allied+Electronics; ComponentLink5Description: https://datasheet.ciiva.com/16768/70260748-16768437.pdf?src-supplier=Allied+Electronics; ComponentLink6URL: https://datasheet.ciiva.com/16774/70260748-16774550.pdf?src-supplier=Allied+Electronics; ComponentLink6Description: https://datasheet.ciiva.com/16774/70260748-16774550.pdf?src-supplier=Allied+Electronics; ComponentLink7URL: https://datasheet.ciiva.com/46373/1678782-46373339.pdf?src-supplier=Element14; ComponentLink7Description: https://datasheet.ciiva.com/46373/1678782-46373339.pdf?src-supplier=Element14; ComponentLink8URL: https://datasheet.ciiva.com/46373/1678782-46373340.pdf?src-supplier=Element14; ComponentLink8Description: https://datasheet.ciiva.com/46373/1678782-46373340.pdf?src-supplier=Element14; ComponentLink9URL: https://datasheet.ciiva.com/7942/aoa0000ce2-7942427.pdf?src-supplier=Element14; ComponentLink9Description: https://datasheet.ciiva.com/7942/aoa0000ce2-7942427.pdf?src-supplier=Element14; ComponentLink10URL: https://datasheet.ciiva.com/9198/aoa0000ce2-9198923.pdf?src-supplier=Avnet; ComponentLink10Description: https://datasheet.ciiva.com/9198/aoa0000ce2-9198923.pdf?src-supplier=Avnet; ComponentLink11URL: https://datasheet.ciiva.com/24070/aoa0000ce2-24070269.pdf?src-supplier=Mouser; ComponentLink11Description: https://datasheet.ciiva.com/24070/aoa0000ce2-24070269.pdf?src-supplier=Mouser
R60 R61 = ERJ-3EKF2702V: Res Thick Film 0603 27K Ohm 1% 1/10W ±100ppm/°C Molded SMD Punched Carrier T/R; Mfr_Name: Panasonic; Value: 27kR; Voltage Rating: 75V; Power Rating: 100mW; Supplier: Digikey; Supplier Part Number: P27.0KHCT-ND; Manufacturer: Panasonic; Manufacturer Part Number: ERJ-3EKF2702V; RoHS: Yes; Category: Chip SMD Resistors; Stock: 194466; Pricing: 1=0.1, 10=0.035, 100=0.0177, 1000=0.01014, 2500=0.00847 (USD); Mounting Technology: Surface Mount; Case/Package: 0603; Pins: 2; Case Code (Imperial): 0603; Case Code (Metric): 1608; Weight: 7.1E-05oz; Contact Plating: Tin; Min Operating Temperature: -55°C; Max Operating Temperature: 155°C; Tolerance: 1%; Packaging: Tape and Reel; Package Quantity: 1; Resistor Type: Thick Film; Termination: SMD/SMT; Number of Terminations: 2; Temperature Coefficient: 100ppm/°C; Max Power Dissipation: 100mW; Voltage Rating (DC): 75V; Features: Automotive AEC-Q200; Series: ERJ; Construction: Rectangular; Resistance Tolerance: 1%; Length: 1.6mm; Width: 0.8mm; Height: 0.022inch; Depth: 0.8mm; Radiation Hardening: No; Reach SVHC Compliant: No; Military Standard: Not; Lead Free: Lead Free; RoHS Compliant: Yes; ComponentLink1URL: https://datasheet.ciiva.com/6082/aoa0000ce2-6082174.pdf?src-supplier=Farnell; ComponentLink1Description: https://datasheet.ciiva.com/6082/aoa0000ce2-6082174.pdf?src-supplier=Farnell; ComponentLink2URL: https://datasheet.ciiva.com/9116/aoa0000ce2-9116938.pdf?src-supplier=Avnet; ComponentLink2Description: https://datasheet.ciiva.com/9116/aoa0000ce2-9116938.pdf?src-supplier=Avnet; ComponentLink3URL: https://datasheet.ciiva.com/9191/aoa0000ce2-9191209.pdf?src-supplier=Avnet; ComponentLink3Description: https://datasheet.ciiva.com/9191/aoa0000ce2-9191209.pdf?src-supplier=Avnet; ComponentLink4URL: https://datasheet.ciiva.com/24124/aoa0000ce2-24124345.pdf?src-supplier=Mouser; ComponentLink4Description: https://datasheet.ciiva.com/24124/aoa0000ce2-24124345.pdf?src-supplier=Mouser; ComponentLink5URL: https://datasheet.ciiva.com/46420/1678782-46420331.pdf?src-supplier=Element14; ComponentLink5Description: https://datasheet.ciiva.com/46420/1678782-46420331.pdf?src-supplier=Element14; ComponentLink6URL: https://datasheet.ciiva.com/7886/aoa0000ce2-7886728.pdf?src-supplier=Element14; ComponentLink6Description: https://datasheet.ciiva.com/7886/aoa0000ce2-7886728.pdf?src-supplier=Element14; ComponentLink7URL: https://datasheet.ciiva.com/16765/70260748-16765016.pdf?src-supplier=Allied+Electronics; ComponentLink7Description: https://datasheet.ciiva.com/16765/70260748-16765016.pdf?src-supplier=Allied+Electronics; ComponentLink8URL: https://datasheet.ciiva.com/16785/70260748-16785821.pdf?src-supplier=Allied+Electronics; ComponentLink8Description: https://datasheet.ciiva.com/16785/70260748-16785821.pdf?src-supplier=Allied+Electronics
R62-R69 = ERJ-3EKF4990V: SMD Chip Resistor, 499 Ohm, ï¿½ 1%, 100 mW, 0603 [1608 Metric], Thick Film, Precision; Mfr_Name: Panasonic; Power Rating: 100mW; Voltage Rating: 75V; Temperature Coefficient: 100ppm/°C; Voltage Rating (DC): 50V; Supplier: Digikey; Supplier Part Number: P499HCT-ND; Manufacturer: Panasonic; Manufacturer Part Number: ERJ-3EKF4990V; RoHS: Yes; Category: Chip SMD Resistors; Stock: 179220; Pricing: 1=0.1, 10=0.035, 100=0.0177, 1000=0.01014, 2500=0.00847 (USD); Mounting Technology: Surface Mount; Case/Package: 0603; Case Code (Imperial): 0603; Case Code (Metric): 1608; Contact Plating: Tin; Min Operating Temperature: -55°C; Max Operating Temperature: 155°C; Value: 499R; Tolerance: 1%; Packaging: Tape and Reel; Package Quantity: 1; Termination: SMD/SMT; Resistor Type: Thick Film; Number of Terminations: 2; Max Power Dissipation: 100mW; Features: Automotive AEC-Q200; Series: ERJ; Resistance Tolerance: 1%; Construction: Rectangular; Technology: THICK FILM; Length: 1.6mm; Width: 0.8mm; Height: 0.45mm; Depth: 0.8mm; Radiation Hardening: No; Reach SVHC Compliant: No; Military Standard: Not; Lead Free: Lead Free; RoHS Compliant: Yes; ComponentLink1URL: https://datasheet.ciiva.com/48531/aoa0000ce2-48531014.pdf?src-supplier=Avnet; ComponentLink1Description: https://datasheet.ciiva.com/48531/aoa0000ce2-48531014.pdf?src-supplier=Avnet; ComponentLink2URL: https://datasheet.ciiva.com/30248/aoa0000ce2-30248877.pdf?src-supplier=Onlinecomponents.com; ComponentLink2Description: https://datasheet.ciiva.com/30248/aoa0000ce2-30248877.pdf?src-supplier=Onlinecomponents.com; ComponentLink3URL: https://datasheet.ciiva.com/43460/426256-43460456.pdf?src-supplier=Farnell; ComponentLink3Description: https://datasheet.ciiva.com/43460/426256-43460456.pdf?src-supplier=Farnell; ComponentLink4URL: https://datasheet.ciiva.com/9117/aoa0000ce2-9117110.pdf?src-supplier=Avnet; ComponentLink4Description: https://datasheet.ciiva.com/9117/aoa0000ce2-9117110.pdf?src-supplier=Avnet
U20-U23 = TPD4E02B04DQAR: TVS DIODE 3.6V 8.8V 10USON / 4-Channel ESD Protection Diode for USB Type-C and HDMI 2.0; Mfr_Name: Texas Instruments; CompType: IC; Number of Bidirectional Channels: 4; Min Breakdown Voltage: 5.5V; Peak Pulse Power: 17W; Power Line Protection: No; Peak Pulse Current: 5A; Interface: USB,HDMI; Diode Type: ZENER; Direction: 211Direction; Breakdown Voltage: 6.4V; TYPE: TYPE; RefDes: RefDes; Application_BuildNumber: *; PartNumber: TPD4E02B04DQAR; PackageReference: DQA0010A; MountType: SMT; RoHS: Y; Manufacturer: Texas Instruments; Supplier: Digikey; Supplier Part Number: 296-43875-1-ND; Manufacturer Part Number: TPD4E02B04DQAR; Category: Integrated Circuits (ICs); Mounting Technology: Surface Mount; Pins: 10; Min Operating Temperature: -40°C; Max Operating Temperature: 125°C; Packaging: Cut Tape; Reverse Standoff Voltage: 3.6V; Operating Supply Voltage: 3.6V; Number of Channels: 4; Series: -; Length: 2.5mm; Width: 1mm; Height: 550um; Thickness: 500um; Reach SVHC Compliant: No; Lead Free: Lead Free; RoHS Compliant: Yes; ComponentLink1URL: http://www.ti.com/lit/ds/symlink/tpd4e02b04.pdf?src-supplier=Digikey; ComponentLink1Description: http://www.ti.com/lit/ds/symlink/tpd4e02b04.pdf?src-supplier=Digikey; ComponentLink2URL: http://www.ti.com/lit/ds/symlink/tpd4e02b04.pdf?src-supplier=Farnell; ComponentLink2Description: http://www.ti.com/lit/ds/symlink/tpd4e02b04.pdf?src-supplier=Farnell; ComponentLink3URL: http://www.ti.com/lit/ds/symlink/tpd4e02b04.pdf?src-supplier=Newark; ComponentLink3Description: http://www.ti.com/lit/ds/symlink/tpd4e02b04.pdf?src-supplier=Newark; ComponentLink4URL: http://www.ti.com/general/docs/lit/getliterature.tsp?genericPartNumber=TPD4E02B04&amp;&amp;fileType=pdf&src-supplier=Element14; ComponentLink4Description: http://www.ti.com/general/docs/lit/getliterature.tsp?genericPartNumber=TPD4E02B04&amp;&amp;fileType=pdf&src-supplier=Element14